# EAGLE design BATT_CPU_mod (EAGLE 9.6.2)
COMPANY: ADAFRUIT INDUSTRIES; DRAWN: KTOWN; REV: B
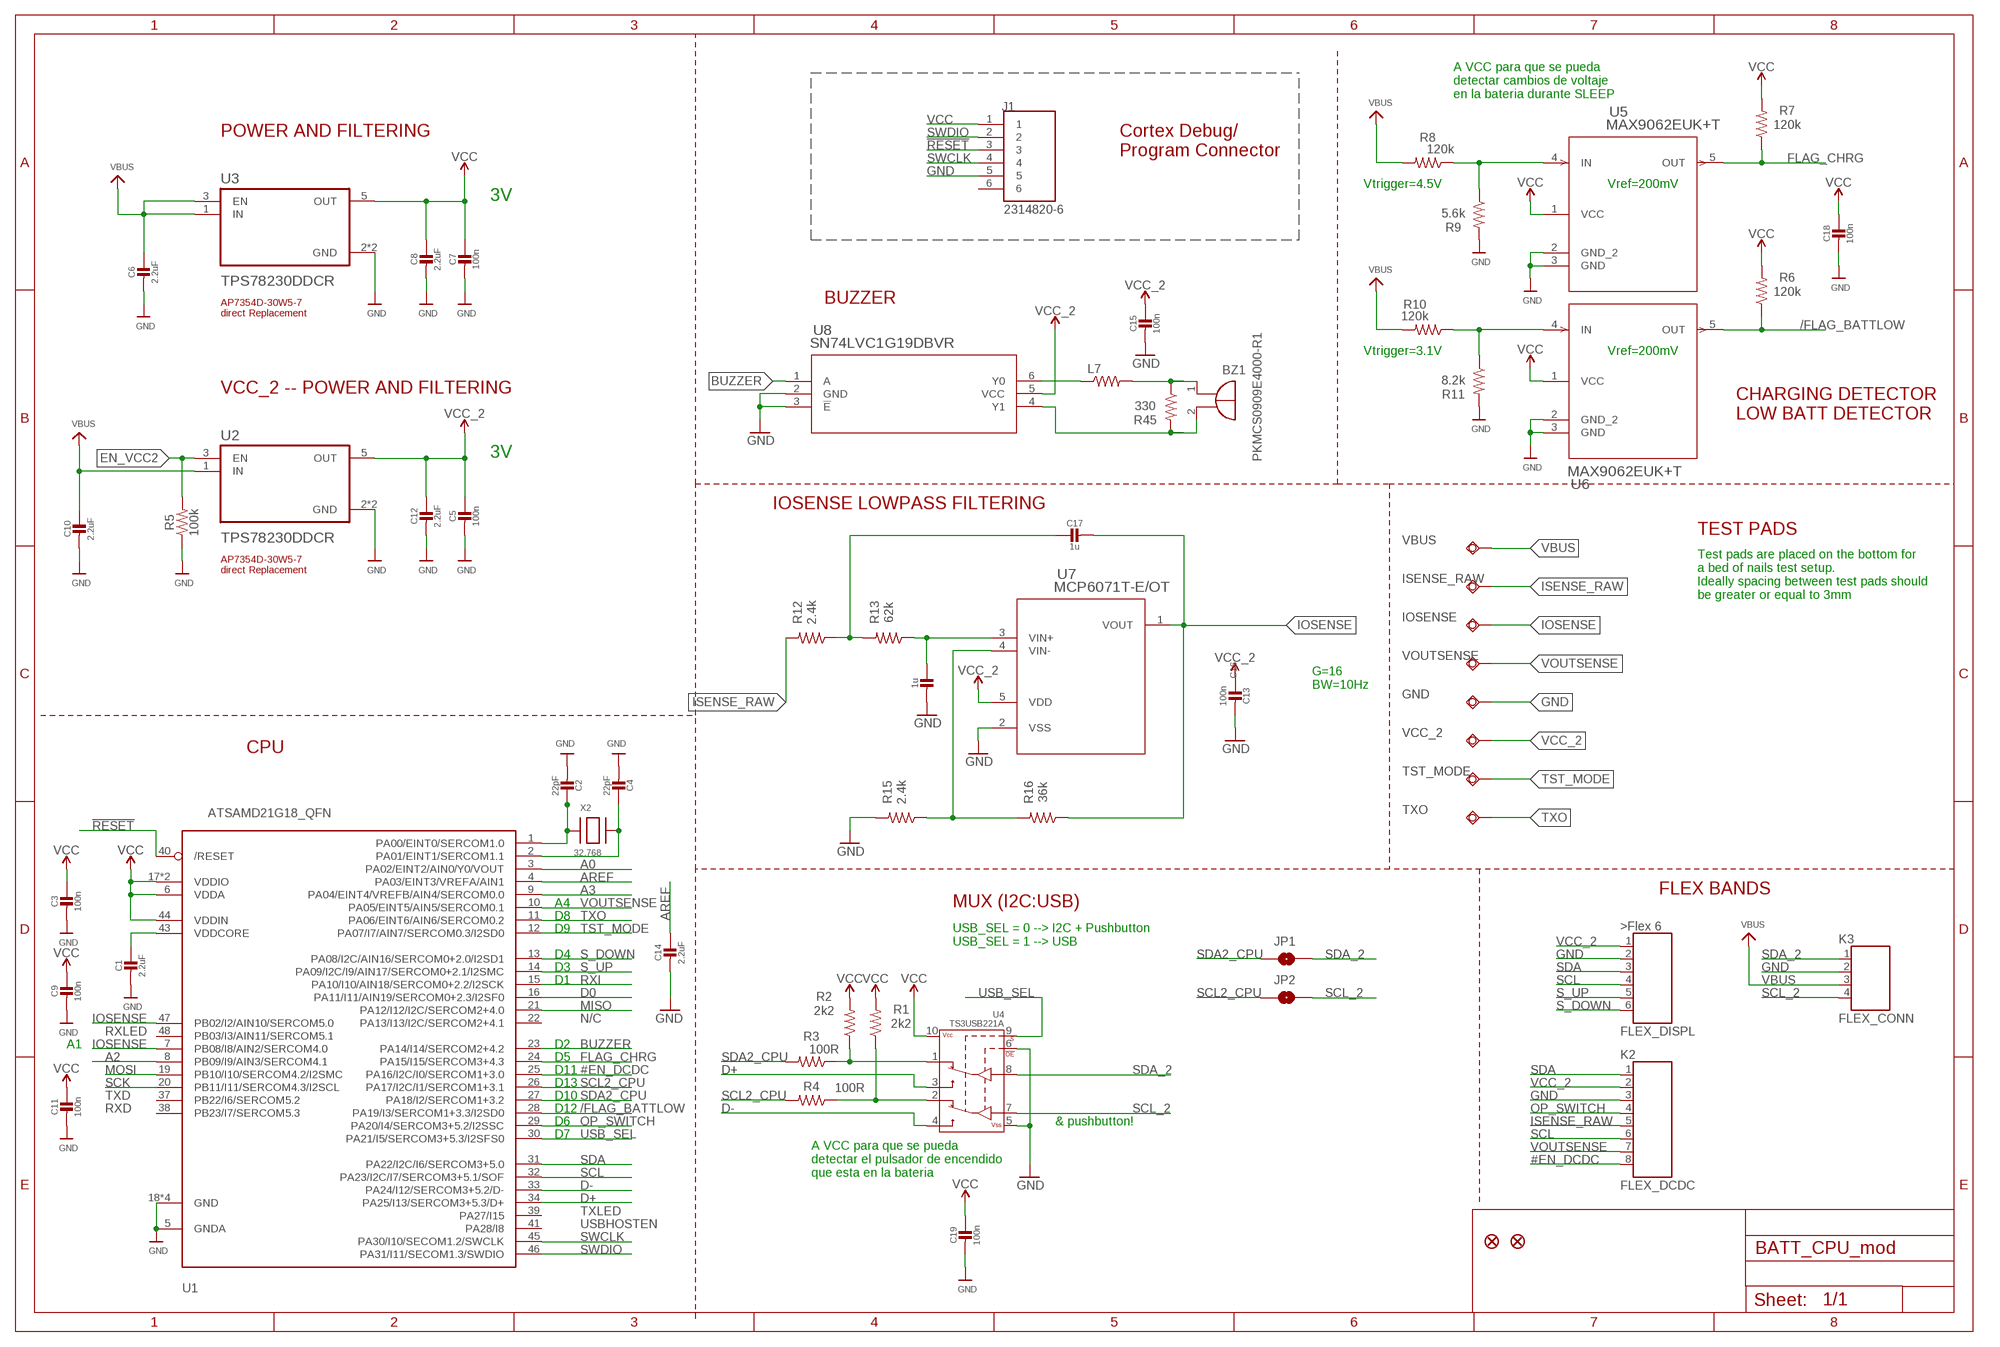
[diagram p0: schematic, sheet 1]

## Parts
BZ1  PKMCS0909E4000-R1  [PKMCS0909]
C1  2.2uF  CAP_CERAMIC0603_NO  [0603-NO]
C2  22pF  CAP_CERAMIC0603_NO  [0603-NO]
C3  100n  CAP_CERAMIC0603_NO  [0603-NO]
C4  22pF  CAP_CERAMIC0603_NO  [0603-NO]
C5  100n  CAP_CERAMIC0603_NO  [0603-NO]
C6  2.2uF  CAP_CERAMIC0805-NOOUTLINE  [0805-NO]
C7  100n  CAP_CERAMIC0603_NO  [0603-NO]
C8  2.2uF  CAP_CERAMIC0805-NOOUTLINE  [0805-NO]
C9  100n  CAP_CERAMIC0603_NO  [0603-NO]
C10  2.2uF  CAP_CERAMIC0805-NOOUTLINE  [0805-NO]
C11  100n  CAP_CERAMIC0603_NO  [0603-NO]
C12  2.2uF  CAP_CERAMIC0805-NOOUTLINE  [0805-NO]
C13  100n  CAP_CERAMIC0603_NO  [0603-NO]
C14  2.2uF  CAP_CERAMIC0603_NO  [0603-NO]
C15  100n  CAP_CERAMIC0603_NO  [0603-NO]
C16  1u  CAP_CERAMIC0603_NO  [0603-NO]
C17  1u  CAP_CERAMIC0603_NO  [0603-NO]
C18  100n  CAP_CERAMIC0603_NO  [0603-NO]
C19  100n  CAP_CERAMIC0603_NO  [0603-NO]
GND  TESTPAD_TPSQB1,27  [TESTPAD_B1,27]
IOSENSE  TESTPAD_TPSQB1,27  [TESTPAD_B1,27]
ISENSE_RAW  TESTPAD_TPSQB1,27  [TESTPAD_B1,27]
J1  2314820-6  [TE_2314820-6]
JP1  JUMPER-SMT_2_NO_SILK  [SMT-JUMPER_2_NO_SILK]
JP2  JUMPER-SMT_2_NO_SILK  [SMT-JUMPER_2_NO_SILK]
K1  FLEX_DISPL  FLEX6  [FLEX6]
K2  FLEX_DCDC  FLEX8  [FLEX8]
K3  FLEX_CONN  FLEX4  [FLEX4]
L7  MMZ2012Y202BT000  RESISTOR0805-RES  [0805]
R1  2k2  RESISTOR0603  [0603]
R2  2k2  RESISTOR0603  [0603]
R3  100R  RESISTOR0603  [0603]
R4  100R  RESISTOR0603  [0603]
R5  100k  RESISTOR0603  [0603]
R6  120k  RESISTOR0603  [0603]
R7  120k  RESISTOR0603  [0603]
R8  120k  RESISTOR0603  [0603]
R9  5.6k  RESISTOR0603  [0603]
R10  120k  RESISTOR0603  [0603]
R11  8.2k  RESISTOR0603  [0603]
R12  2.4k  RESISTOR0603  [0603]
R13  62k  RESISTOR0603  [0603]
R15  2.4k  RESISTOR0603  [0603]
R16  36k  RESISTOR0603  [0603]
R45  330  RESISTOR0603  [0603]
TST_MODE  TESTPAD_TPSQB1,27  [TESTPAD_B1,27]
TXO  TESTPAD_TPSQB1,27  [TESTPAD_B1,27]
U1  ATSAMD21G18_QFN  ATSAMD21J_QFN  [TQFN48_7MM]
U2  TPS78230DDCR  [SOT95P280X110-5N]
U3  TPS78230DDCR  [SOT95P280X110-5N]
U4  TS3USB221A  [QFN-10-RSE]
U5  MAX9062EUK+T  [21-0057F_MXM]
U6  MAX9062EUK+T  [21-0057F_MXM]
U7  MCP6071T-E/OT  [SOT-23-5_MC_MCH]
U8  SN74LVC1G19DBVR  [DBV6]
U$34  FIDUCIAL""  [FIDUCIAL_1MM]
U$35  FIDUCIAL""  [FIDUCIAL_1MM]
VBUS  TESTPAD_TPSQB1,27  [TESTPAD_B1,27]
VCC_2  TESTPAD_TPSQB1,27  [TESTPAD_B1,27]
VOUTSENSE  TESTPAD_TPSQB1,27  [TESTPAD_B1,27]
X2  32.768  XTAL-3.2X1.5  [XTAL3215]

## Nets
!RESET: J1.3 U1.40(/RESET)
#EN_DCDC: K2.8 U1.25(PA16/I2C/I0/SERCOM1+3.0)
/FLAG_BATTLOW: R6.1 U1.28(PA19/I3/SERCOM1+3.3/I2SD0) U6.5(OUT)
A0: U1.3(PA02/EINT2/AIN0/Y0/VOUT)
A2: U1.8(PB09/I9/AIN3/SERCOM4.1)
A3: U1.9(PA04/EINT4/VREFB/AIN4/SERCOM0.0)
AREF: C14.1 U1.4(PA03/EINT3/VREFA/AIN1)
BUZZER: U1.23(PA14/I14/SERCOM2+4.2) U8.1(A)
D0: U1.16(PA11/I11/AIN19/SERCOM0+2.3/I2SF0)
D+: U1.34(PA25/I13/SERCOM3+5.3/D+) U4.3(2D+)
D-: U1.33(PA24/I12/SERCOM3+5.2/D-) U4.4(2D-)
EN_VCC2: R5.2 U2.3(EN)
FLAG_CHRG: R7.1 U1.24(PA15/I15/SERCOM3+4.3) U5.5(OUT)
GND: C1.2 C2.2 C3.2 C4.2 C5.2 C6.2 C7.2 C8.2 C9.2 C10.2 C11.2 C12.2 C13.2 C14.2 C15.2 C16.2 C18.2 C19.2 GND.TP J1.5 K1.2 K2.3 K3.2 R5.1 R9.2 R11.2 R15.2 U1.5(GNDA) U1.18(GND) U1.35(GND) U1.42(GND) U1.THERMAL(GND) U2.2(GND) U2.4(GND) U3.2(GND) U3.4(GND) U4.5(VSS) U4.6(!OE) U5.2(GND_2) U5.3(GND) U6.2(GND_2) U6.3(GND) U7.2(VSS) U8.2(GND) U8.3(!E)
IOSENSE: C17.2 IOSENSE.TP R16.1 U1.7(PB08/I8/AIN2/SERCOM4.0) U1.47(PB02/I2/AIN10/SERCOM5.0) U7.1(VOUT)
ISENSE_RAW: ISENSE_RAW.TP K2.5 R12.2
MISO: U1.21(PA12/I12/I2C/SERCOM2+4.0)
MOSI: U1.19(PB10/I10/SERCOM4.2/I2SMC)
N$1: R15.1 R16.2 U7.4(VIN-)
N$2: R2.1 R3.1 U4.1(1D+)
N$3: R1.1 R4.1 U4.2(1D-)
N$5: C2.1 U1.1(PA00/EINT0/SERCOM1.0) X2.P$1
N$7: C4.1 U1.2(PA01/EINT1/SERCOM1.1) X2.P$2
N$8: C17.1 R12.1 R13.2
N$10: R10.1 R11.1 U6.4(IN)
N$11: R8.1 R9.1 U5.4(IN)
N$13: C16.1 R13.1 U7.3(VIN+)
N$17: L7.1 U8.6(Y0)
N$19: BZ1.1(+) L7.2 R45.1
N$22: BZ1.2(-) R45.2 U8.4(Y1)
OP_SWITCH: K2.4 U1.29(PA20/I4/SERCOM3+5.2/I2SSC)
RXI: U1.15(PA10/I10/AIN18/SERCOM0+2.2/I2SCK)
S_DOWN: K1.6 U1.13(PA08/I2C/AIN16/SERCOM0+2.0/I2SD1)
S_UP: K1.5 U1.14(PA09/I2C/I9/AIN17/SERCOM0+2.1/I2SMC)
SCK: U1.20(PB11/I11/SERCOM4.3/I2SCL)
SCL: K1.4 K2.6 U1.32(PA23/I2C/I7/SERCOM3+5.1/SOF)
SCL2_CPU: JP2.1 R4.2 U1.26(PA17/I2C/I1/SERCOM1+3.1)
SCL_2: JP2.2 K3.4 U4.7(D-)
SDA: K1.3 K2.1 U1.31(PA22/I2C/I6/SERCOM3+5.0)
SDA2_CPU: JP1.1 R3.2 U1.27(PA18/I2/SERCOM1+3.2)
SDA_2: JP1.2 K3.1 U4.8(D+)
SWCLK: J1.4 U1.45(PA30/I10/SECOM1.2/SWCLK)
SWDIO: J1.2 U1.46(PA31/I11/SECOM1.3/SWDIO)
TST_MODE: TST_MODE.TP U1.12(PA07/I7/AIN7/SERCOM0.3/I2SD0)
TXO: TXO.TP U1.11(PA06/EINT6/AIN6/SERCOM0.2)
USB_SEL: U1.30(PA21/I5/SERCOM3+5.3/I2SFS0) U4.9(S)
VBUS: C6.1 C10.1 K3.3 R8.2 R10.2 U2.1(IN) U3.1(IN) U3.3(EN) VBUS.TP
VCC: C3.1 C7.1 C8.1 C9.1 C11.1 C18.1 C19.1 J1.1 R1.2 R2.2 R6.2 R7.2 U1.6(VDDA) U1.17(VDDIO) U1.36(VDDIO) U1.44(VDDIN) U3.5(OUT) U4.10(VCC) U5.1(VCC) U6.1(VCC)
VCC_2: C5.1 C12.1 C13.1 C15.1 K1.1 K2.2 U2.5(OUT) U7.5(VDD) U8.5(VCC) VCC_2.TP
VDDCORE: C1.1 U1.43(VDDCORE)
VOUTSENSE: K2.7 U1.10(PA05/EINT5/AIN5/SERCOM0.1) VOUTSENSE.TP
Unconnected: J1.6 U1.22(PA13/I13/I2C/SERCOM2+4.1) U1.37(PB22/I6/SERCOM5.2) U1.38(PB23/I7/SERCOM5.3) U1.39(PA27/I15) U1.41(PA28/I8) U1.48(PB03/I3/AIN11/SERCOM5.1)

## Notes on the sheet
- A VCC para que se pueda
  detectar cambios de voltaje
  en la bateria durante SLEEP
- Cortex Debug/
  Program Connector
- POWER AND FILTERING
- Vtrigger=4.5V | Vref=200mV
- 3V
- BUZZER
- AP7354D-30W5-7 
  direct Replacement
- Vtrigger=3.1V | Vref=200mV
- VCC_2 -- POWER AND FILTERING
- CHARGING DETECTOR
  LOW BATT DETECTOR
- 3V
- IOSENSE LOWPASS FILTERING
- TEST PADS
- AP7354D-30W5-7 
  direct Replacement
- Test pads are placed on the bottom for
  a bed of nails test setup.
  Ideally spacing between test pads should 
  be greater or equal to 3mm
- G=16
  BW=10Hz
- CPU
- FLEX BANDS
- A4 | MUX (I2C:USB)
- D8
- D9
- USB_SEL = 0 --> I2C + Pushbutton
  USB_SEL = 1 --> USB
- D4
- D3
- D1
- N/C
- RXLED
- A1 | D2
- D5
- D11
- D13
- TXD | D10
- RXD | D12
- D6 | & pushbutton!
- D7
- A VCC para que se pueda
  detectar el pulsador de encendido
  que esta en la bateria
- TXLED
- USBHOSTEN

## Library data of the parts
BZ1 = buzzer:PKMCS0909E4000-R1: PKMCS0909E4000-R1 Source : http://www.murata.com/~/media/webrenewal/products/sound/sounder/vppt-buzj083-d.ashx
C1-C19 = microbuilder:CAP_CERAMIC: Ceramic Capacitors For new designs, use the packages preceded by an '_' character since they are more reliable: The following footprints should be used on most boards: _0402 - Standard footprint for regular board layouts _0603 - Standard footprint for regular board layouts _0805 - Standard footprint for regular board layouts _1206 - Standard footprint for regular board layouts For extremely tight-pitch boards where space is at a premium, the following 'micro-pitch' footprints can be used (smaller pads, no silkscreen outline, etc.): _0402MP - Micro-pitch footprint for very dense/compact boards _0603MP - Micro-pitch footprint for very dense/compact boards _0805MP - Micro-pitch footprint for very dense/compact boards _1206MP - Micro-pitch footprint for very dense/compact boards
GND IOSENSE ISENSE_RAW TST_MODE TXO VBUS VCC_2 VOUTSENSE = BeagleBone_Blue_R3:TESTPAD_TPSQ: Test pad
J1 = connector 2x3-2mm:2314820-6; COMMENT: 2314820-6; DESCRIPTION: Socket Receptacle 6P,2MM,B-B,REC,DRVT,2.7,0.1AU,TB 6 POS; DIGI-KEY_PART_NUMBER: 17-2314820-6-ND; MF: TE Connectivity; MP: 2314820-6; PACKAGE: None; PURCHASE-URL: https://pricing.snapeda.com/search/part/2314820-6/?ref=eda
JP1 JP2 = SparkFun-Jumpers:JUMPER-SMT_2_NO: Normally open jumper This jumper has two pads in close proximity to each other. Apply solder to close the connection. Round pads are easier to solder for beginners, but are a lot larger. SparkFun Product that uses the round pads: SparkFun EL Sequencer <https://www.sparkfun.com/products/12781>
K1 = Flex_Faja_connector:FLEX6: WR-FPC 1mm SMT Horiz. Bot. Contact Hinge type WR-FPC 1mm 06 pins Hinge type SMT Horizontal Bottom Contact ;=>Code : Con_FPC_ZIF_1.00_6861xx148922_686106148922 <http://katalog.we-online.de/media/images/eican/Con_FPC_ZIF_1.00_686110148922_pf2.jpg> Details see: http://katalog.we-online.de/em/datasheet/6861xx148922.pdf Created 2014-10-08, Karrer Zheng 2014 (C) Wurth Elektronik
K2 = Flex_Faja_connector:FLEX8: WR-FPC 1mm SMT Horiz. Bot. Contact Hinge type WR-FPC 1mm 08 pins Hinge type SMT Horizontal Bottom Contact ;=>Code : Con_FPC_ZIF_1.00_6861xx148922_686108148922 <http://katalog.we-online.de/media/images/eican/Con_FPC_ZIF_1.00_686110148922_pf2.jpg> Details see: http://katalog.we-online.de/em/datasheet/6861xx148922.pdf Created 2014-10-08, Karrer Zheng 2014 (C) Wurth Elektronik
K3 = Flex4:FLEX4
L7 = SparkFun:RESISTOR: Resistor Basic schematic elements and footprints for 0603, 1206, and PTH resistors.
R1-R13 R15 R16 R45 = SparkFun-Resistors:RESISTOR: Generic Resistor Package
U1 = microbuilder:ATSAMD21J
U2 U3 = TPS78230DDCR:TPS78230DDCR: Check prices <https://pricing.snapeda.com/parts/TPS78230DDCR/Texas%20Instruments/view-part?ref=eda>; AVAILABILITY: Good; DESCRIPTION: 150-mA, nano-IQ, low-dropout voltage regulator with enable from -40C to +125C 5-SOT-23-THIN -40 to 125; MF: Texas Instruments; MP: TPS78230DDCR; PACKAGE: SOT-23-THN-5 Texas Instruments; PRICE: None; PURCHASE-URL: https://pricing.snapeda.com/search/part/TPS78230DDCR/?ref=eda
U4 = SparkFun-IC-Special-Function:TS3USB221A: DPDT Analog Mux DPDT Analog Mux Vcc 2.5 to 3.3V Passes up to 5.5V at 3.3V supply 900MHz BW, 6Ω switch resistance SparkFun Products SparkFun FTDI SmartBasic <https://www.sparkfun.com/products/12935> (DEV-12935); PROD_ID: IC-12115
U5 U6 = MAX9062:MAX9062EUK+T; BUILT_BY: EMA_UL_Team; MANUFACTURER_PART_NUMBER: MAX9062EUK+T; SOURCELIBRARY: Maxim_2014-06-20; VENDOR: Maxim Integrated Products
U7 = MCP6071:MCP6071T-E/OT; BUILT_BY: EMA_Jessica; COPYRIGHT: Copyright (C) 2018 Accelerated Designs. All rights reserved; MANUFACTURER_PART_NUMBER: MCP6071T-E/OT; SOURCELIBRARY: Microchip_2019-08-23_21; VENDOR: Microchip
U8 = SN74LVC1G19DBVR:SN74LVC1G19DBVR; DATASHEET_URL: http://www.ti.com/lit/gpn/SN74LVC1G19; DESCRIPTION: 1-of-2 Decoder/Demultiplexer; FAMILY_NAME: LL Decoder, Mux/Demux; GENERIC_PART_NUMBER: SN74LVC1G19; INDUSTRY_STD_PKG_TYPE: SOT-23; MANUFACTURER: Texas Instruments; MANUFACTURER_PART_NUMBER: SN74LVC1G19DBVR; PACKAGE_DESIGNATOR: DBV; PIN_COUNT: 6; VENDOR: Texas Instruments
U$34 U$35 = microbuilder:FIDUCIAL: Fiducial Alignment Points Various fiducial points for machine vision alignment.; BOM: EXCLUDE
X2 = adafruit2:XTAL: Low cost SMT crystals, no capacitors included http://www.ladyada.net/library/eagle

## Net classes
2 gnd: width 0.305 mm, drill 0.483 mm, clearance 0.203 mm

## Board
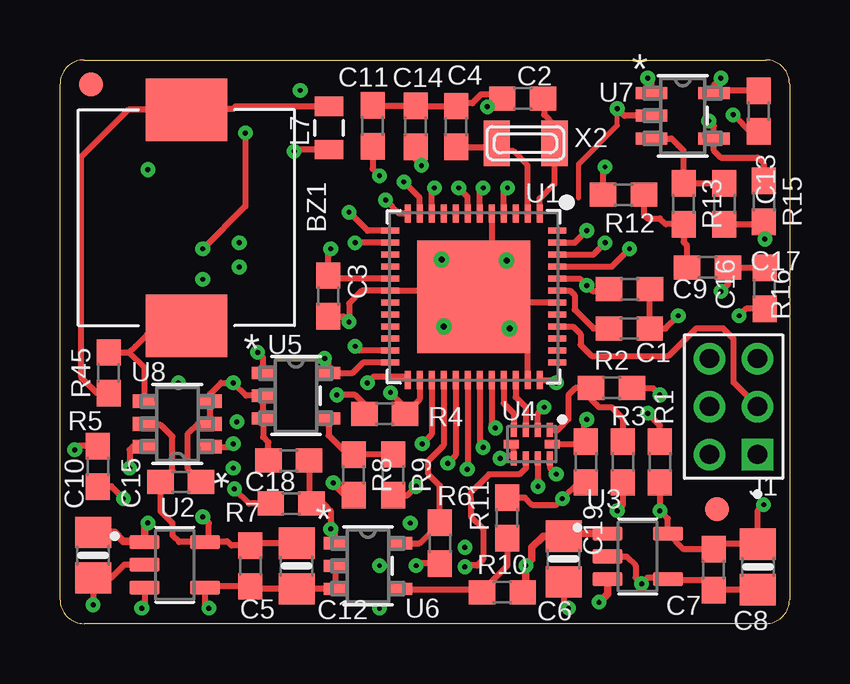
[diagram p1: board, top side]
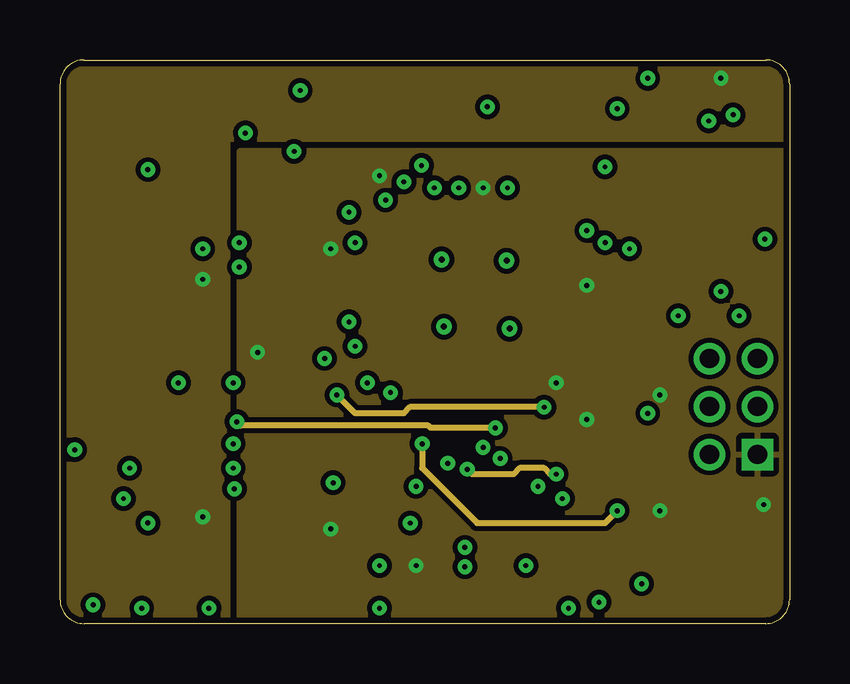
[diagram p2: board, inner layer Route2]
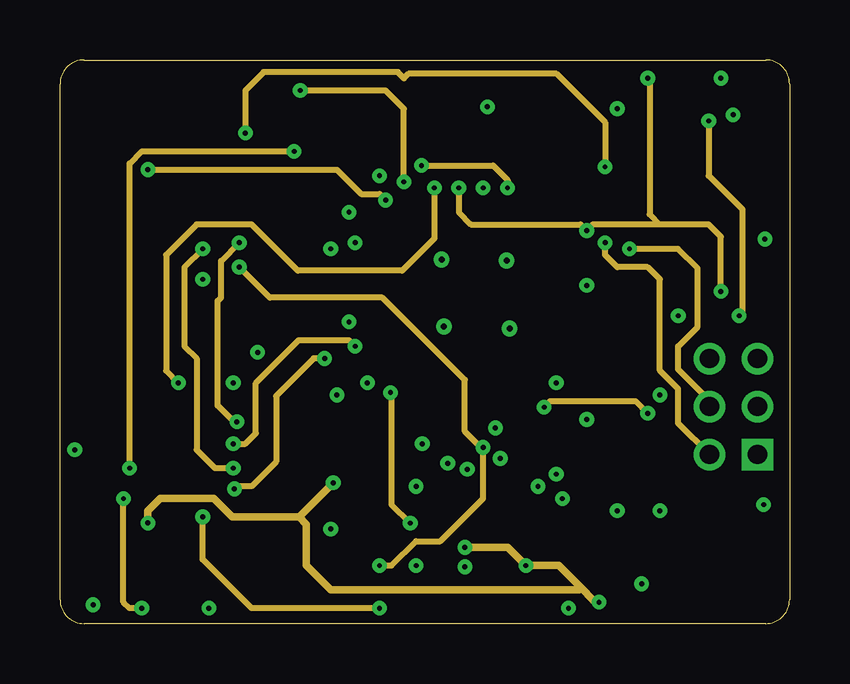
[diagram p3: board, inner layer Route15]
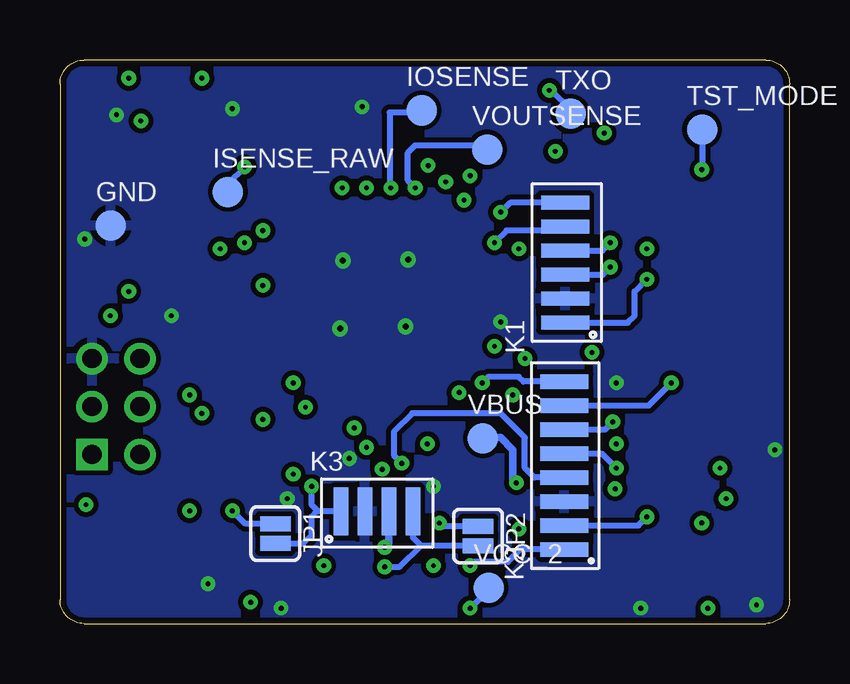
[diagram p4: board, bottom side, seen from below]

Size 30.4 x 23.5 mm. Coordinates in mm from the lower left corner, seen from the top.
Outline: 1,23.5 29.4,23.5 arc-90 30.4,22.5 30.4,1 arc-90 29.4,0 1,0 arc-90 0,1 0,22.5 arc-90 1,23.5
Copper layers (1+2*15+16): Top 0.035mm / dielectric 1.5mm / Route2 0.035mm / dielectric 0.15mm / Route15 0.035mm / dielectric 0.2mm / Bottom 0.035mm
Design rules "adafruit *": minimum track width 8mil, minimum drill 0.2mm, track to track 8mil, track to pad 8mil, pad to pad 8mil, via to via 8mil, smd to smd 8mil, copper to edge 10mil, drill to drill 8mil, minimum pad ring 10mil, minimum via ring 8mil, stop-mask expansion 2mil, vias tented up to drill 20mil, thermal gap 10mil
tRestrict: area -2.4,8.3 to -2.1,11.1; area -1.7,13.5 to 3.3,13.8; area 2.8,11.1 to 3.3,13.6

### Footprints (pad centres in the part's own frame; a part is rotated, then mirrored left to right if it is on the bottom)
PKMCS0909 = smd 2.6 x 3.4: 1 -4.5,0; 2 4.5,0
0603-NO = smd 1.1 x 1: 1 -0.85,0; 2 0.85,0
0805-NO = smd 1.3 x 1.5: 1 -0.95,0; 2 0.95,0
TESTPAD_B1,27 = smd 1.27 x 1.27: TP 0,0
TE_2314820-6 = drill 0.8 pad 1.15 square: 1 0,0 | drill 0.8 pad 1.15: 2 0,2; 3 2,0; 4 2,2; 5 4,0; 6 4,2
SMT-JUMPER_2_NO_SILK = smd 0.635 x 1.27: 1 -0.406,0; 2 0.406,0
FLEX6 = smd 0.6 x 2: 1 -2.5,0.25; 2 -1.5,0.25; 3 -0.5,0.25; 4 0.5,0.25; 5 1.5,0.25; 6 2.5,0.25
FLEX8 = smd 0.6 x 2: 1 -3.5,0.25; 2 -2.5,0.25; 3 -1.5,0.25; 4 -0.5,0.25; 5 0.5,0.25; 6 1.5,0.25; 7 2.5,0.25; 8 3.5,0.25
FLEX4 = smd 0.6 x 2: 1 -3.77,1.52; 2 -2.77,1.52; 3 -1.77,1.52; 4 -0.77,1.52
0805 = smd 0.8 x 1.2: 1 -0.9,0; 2 0.9,0
0603 = smd 1.1 x 1: 1 -0.85,0; 2 0.85,0
TQFN48_7MM = smd 0.25 x 0.75: 1 -2.75,-3.475; 2 -2.25,-3.475; 3 -1.75,-3.475; 4 -1.25,-3.475; 5 -0.75,-3.475; 6 -0.25,-3.475; 7 0.25,-3.475; 8 0.75,-3.475; 9 1.25,-3.475; 10 1.75,-3.475; 11 2.25,-3.475; 12 2.75,-3.475; 25 2.75,3.475; 26 2.25,3.475; 27 1.75,3.475; 28 1.25,3.475; 29 0.75,3.475; 30 0.25,3.475; 31 -0.25,3.475; 32 -0.75,3.475; 33 -1.25,3.475; 34 -1.75,3.475; 35 -2.25,3.475; 36 -2.75,3.475 | smd 0.75 x 0.25: 13 3.475,-2.75; 14 3.475,-2.25; 15 3.475,-1.75; 16 3.475,-1.25; 17 3.475,-0.75; 18 3.475,-0.25; 19 3.475,0.25; 20 3.475,0.75; 21 3.475,1.25; 22 3.475,1.75; 23 3.475,2.25; 24 3.475,2.75; 37 -3.475,2.75; 38 -3.475,2.25; 39 -3.475,1.75; 40 -3.475,1.25; 41 -3.475,0.75; 42 -3.475,0.25; 43 -3.475,-0.25; 44 -3.475,-0.75; 45 -3.475,-1.25; 46 -3.475,-1.75; 47 -3.475,-2.25; 48 -3.475,-2.75 | smd 4.7 x 4.7: THERMAL 0,0
SOT95P280X110-5N = smd 1.25 x 0.59: 1 -1.255,0.95; 2 -1.255,0; 3 -1.255,-0.95; 4 1.255,-0.95; 5 1.255,0.95
QFN-10-RSE = smd 0.58 x 0.25: 1 -0.6,0.75; 2 -0.6,0.25; 3 -0.6,-0.25; 4 -0.6,-0.75; 6 0.6,-0.75; 7 0.6,-0.25; 8 0.6,0.25; 9 0.6,0.75 | smd 0.35 x 0.63: 5 0,-0.85; 10 0,0.85
21-0057F_MXM = smd 0.972 x 0.508: 1 -1.362,0.95; 2 -1.362,0; 3 -1.362,-0.95; 4 1.362,-0.95; 5 1.362,0.95
SOT-23-5_MC_MCH = smd 1.31 x 0.508: 1 -1.295,0.95; 2 -1.295,0; 3 -1.295,-0.95; 4 1.295,-0.95; 5 1.295,0.95
DBV6 = smd 0.972 x 0.568: 1 -1.362,0.95; 2 -1.362,0; 3 -1.362,-0.95; 4 1.362,-0.95; 5 1.362,0; 6 1.362,0.95
FIDUCIAL_1MM = smd 1 x 1: 1 0,0
XTAL3215 = smd 1.1 x 1.9: P$1 1.2,0; P$2 -1.2,0

### Placement (x,y rotation side)
BZ1  5.27,16.92 270 top
C1  23.72,12.29 0 top
C2  19.28,21.89 180 top
C3  11.17,13.66 270 top
C4  16.5,20.72 90 top
C5  7.93,2.4 270 top
C6  20.98,2.69 270 top
C7  27.23,2.25 270 top
C8  29.08,2.36 270 top
C9  23.73,13.94 0 top
C10  1.38,2.85 270 top
C11  13.03,20.75 90 top
C12  9.86,2.4 270 top
C13  29.11,21.37 270 top
C14  14.82,20.73 90 top
C15  5.03,5.9 0 top
C16  27.68,17.5 270 top
C17  26.98,14.85 0 top
C18  9.53,6.8 180 top
C19  21.91,6.73 270 top
GND  28.28,16.59 0 bottom
IOSENSE  15.33,21.4 0 bottom
ISENSE_RAW  23.4,17.99 0 bottom
J1  29.06,7.05 90 top
JP1  21.43,3.75 270 bottom
JP2  12.98,3.65 270 bottom
K1  9.1,15.05 90 bottom
K2  9.13,6.59 90 bottom
K3  14.93,3.15 0 bottom
L7  11.21,20.66 90 top
R1  25,6.73 270 top
R2  22.98,9.82 0 top
R3  23.44,6.73 270 top
R4  13.53,8.73 0 top
R5  1.58,6.55 270 top
R6  15.83,3.35 270 top
R7  9.63,5 0 top
R8  12.23,6.2 270 top
R9  13.88,6.2 270 top
R10  18.43,1.3 0 top
R11  18.63,4.4 90 top
R12  23.48,17.88 180 top
R13  25.98,17.5 270 top
R15  29.33,17.6 270 top
R16  29.35,13.98 270 top
R45  2.03,10.45 90 top
TST_MODE  3.65,20.6 0 bottom
TXO  9.12,21.25 0 bottom
U1  17.24,13.63 180 top
U2  4.78,2.45 0 top
U3  24.07,2.8 0 top
U4  19.66,7.48 270 top
U5  9.83,9.5 0 top
U6  12.83,2.4 0 top
U7  25.95,21.17 0 top
U8  4.89,8.32 180 top
U$34  27.37,4.76 90 top
U$35  1.3,22.47 0 top
VBUS  12.78,7.73 0 bottom
VCC_2  12.54,1.5 0 bottom
VOUTSENSE  12.6,19.77 0 bottom
X2  19.4,20.03 0 top

### Tracks (layer width: path | path; a pad name or v marks a point on that pad's centre or on a via)
!RESET
  Top 0.254: J1.3 28.06,10.05 28.06,11.87 27.62,12.32 26.52,12.32 25.36,11.16 22.16,11.16 21.7,11.62 21.7,12.07 21.39,12.38 U1.40
#EN_DCDC  (via drill 0.2)
  Top 0.254: U1.25 14.47,10.15 14.33,10.29 13.06,10.29 v12.81,10.04
  Bottom 0.254: K2.8 11.08,10.09 11.28,10.29 12.55,10.29 v12.81,10.04
/FLAG_BATTLOW
  Top 0.254: U6.5 14.98,3.35 R6.1 15.83,5.74 15.35,6.23 15.35,6.79 15.9,7.34 15.99,7.43 U1.28
AREF  (via drill 0.2)
  Top 0.254: U1.4 18.49,18.01 v18.65,18.16 | C14.1 14.82,19.33 v15.06,19.1
  Route15 0.254: v15.06,19.1 18.05,19.1 18.65,18.49 v18.65,18.16
BUZZER  (via drill 0.2)
  Top 0.254: U1.23 12.48,11.38 v12.3,11.56 | U8.1 7.09,7.37 v7.22,7.5
  Route15 0.254: v7.22,7.5 7.73,7.5 8.16,7.93 8.16,10.03 9.95,11.81 12.04,11.81 v12.3,11.56
D+
  Top 0.254: U1.34 18.99,9.44 19.41,9.02 U4.3
D-
  Top 0.254: U1.33 18.49,9.18 18.9,8.77 U4.4
EN_VCC2  (via drill 0.2)
  Top 0.254: U2.3 3.52,0.76 v3.41,0.64 | R5.2 1.6,5.72 2.14,5.72 v2.65,5.21
  Route15 0.254: v3.41,0.64 2.9,0.64 2.65,0.89 v2.65,5.21
FLAG_CHRG  (via drill 0.2)
  Top 0.254: U1.24 12.63,10.88 12.2,10.45 U5.5 11.19,10.89 v11.03,11.05 | R7.1 7.88,5 v7.27,5.62
  Route15 0.254: v11.03,11.05 10.57,11.05 9,9.49 9,6.74 7.98,5.72 7.37,5.72 v7.27,5.62
GND  (via drill 0.2, 0.25)
  Top 0.203: v23.22,21.47 23.22,20.77 21.61,19.16 21.61,17.75
  Top 0.254: C15.2 5.33,6.45 5.33,7.92 5.73,8.32 U8.2 U8.3 6.25,9.58 6.71,10.04 v7.22,10.04 7.75,9.5 U5.2 U5.3 8.47,7.77 8.68,7.56 C18.2 | C8.2 27.24,1.41 C7.2 27.23,1.8 25.37,1.8 U3.4 25.31,1.85 25.25,1.91 24.49,1.91 v24.24,1.65 23.98,1.91 23.98,2.42 23.6,2.8 U3.2 | C6.2 20.98,0.84 v21.19,0.64 | U6.2 U6.3 C12.2 8.03,1.45 C5.2 6.08,1.55 U2.4 6.03,0.81 v6.2,0.64 | v1.38,0.78 C10.2 2.14,1.91 2.68,2.45 U2.2 | R5.1 0.77,7.4 v0.61,7.24 | U1.THERMAL 16.99,13.88 U1.18 12.58,13.88 12.04,13.34 v12.04,12.58 11.81,12.81 C3.2 | U1.35 19.49,11.38 U1.THERMAL | U1.42 17.49,13.38 U1.THERMAL | U1.5 17.99,14.38 U1.THERMAL | U7.2 23.52,21.17 v23.22,21.47 | C11.2 14.8,21.6 C14.2 C4.2 16.62,21.69 17.18,21.69 17.54,22.05 18.27,22.05 C2.2 18.16,21.89 v17.81,21.55 | v29.37,16.03 29.33,16.07 R15.2 29.23,16.65 C16.2 | C13.2 28.87,20.52 28.81,20.45 v28.05,21.21 | U4.5 18.91,7.38 U4.6 18.91,6.98 18.9,6.99 18.44,6.99 v18.34,6.89 | C19.2 21.61,5.88 v20.93,5.21 20.68,4.96 19.66,4.96 19.37,5.25 R11.2 | v25.76,12.83 25.22,12.29 C1.2 24.57,13.93 C9.2 | R9.2 14.47,5.35 v14.84,5.72
  other vias: 18.73,12.3 18.61,15.13 15.9,15.18 16,12.38
  pour Bottom: -0.15,23.75 30.33,23.75 30.33,0.13 -0.15,0.13
IOSENSE  (via drill 0.2)
  Top 0.254: U1.47 21.44,15.88 v21.95,16.39 | R16.1 27.85,14.83 C17.2 27.83,14.14 v27.54,13.85 | U7.1 24.65,22.57 v24.49,22.74 | U1.7 16.99,17.79 v16.62,18.16
  Route15 0.254: v27.54,13.85 27.54,16.13 27.03,16.64 25,16.64 | 25,16.64 22.2,16.64 v21.95,16.39 21.7,16.64 17.12,16.64 16.62,17.15 v16.62,18.16 | v24.49,22.74 24.57,22.66 24.57,17.07 25,16.64
  Bottom 0.254: IOSENSE.TP 15.41,21.32 16.67,21.32 16.67,18.22 v16.62,18.16
ISENSE_RAW  (via drill 0.2)
  Top 0.254: R12.2 22.63,18.96 v22.71,19.04 | v7.73,20.45 7.73,17.4 v5.95,15.62
  Route15 0.254: v22.71,19.04 22.71,20.9 20.69,22.92 14.52,22.92 14.33,22.74 14.08,22.99 8.49,22.99 7.73,22.23 v7.73,20.45 | v5.95,15.62 5.19,14.86 5.19,11.56 5.69,11.05 5.69,7.24 6.46,6.48 v7.22,6.48
  Bottom 0.254: v22.71,19.04 23.4,18.35 ISENSE_RAW.TP | K2.5 7.83,7.09 v7.22,6.48
N$1  (via drill 0.2)
  Top 0.254: R15.1 29.32,18.46 29.32,19.18 29.06,19.43 27.54,19.43 27.24,19.73 U7.4 27.24,20.74 v27.03,20.96 | R16.2 28.6,13.13 v28.3,12.83
  Route15 0.254: v27.03,20.96 27.03,18.67 28.43,17.27 28.43,12.96 v28.3,12.83
N$2
  Top 0.254: R3.1 23.44,8.54 22.97,9.02 22.46,9.02 22.13,9.34 R2.1 21.48,9.82 21.19,9.53 21.19,8.51 20.76,8.08 U4.1
N$3  (via drill 0.2)
  Top 0.254: R4.1 12.68,9.15 12.3,9.53 v11.54,9.53 | R1.1 25,8.26 v24.49,8.77 | U4.2 19.91,8.76 v20.17,9.02
  Route2 0.254: v20.17,9.02 14.58,9.02 14.33,8.77 12.3,8.77 v11.54,9.53
  Route15 0.254: v20.17,9.02 20.43,9.27 23.98,9.27 v24.49,8.77
N$5
  Top 0.254: U1.1 19.99,17.73 20.6,18.34 X2.P$1 20.6,20.78 20.17,21.21 20.17,21.97 20.13,21.93 C2.1
N$7
  Top 0.254: U1.2 19.49,19.1 18.9,19.69 18.54,19.69 X2.P$2 18.05,19.87 C4.1
N$8
  Top 0.254: C17.1 26.13,15.76 25.98,15.91 R13.2 25.24,16.65 25,16.89 24.49,16.89 24.33,17.05 R12.1
N$10
  Top 0.254: R11.1 18.63,2.4 18.39,2.16 17.58,1.35 R10.1 17.48,1.3 17.38,1.4 14.24,1.4 U6.4
N$11
  Top 0.254: R9.1 R8.1 11.99,7.05 11.19,7.84 U5.4
N$13
  Top 0.254: C16.1 R13.1 25.98,19.72 25.76,19.94 25.48,20.22 U7.3
N$17  (via drill 0.2)
  Top 0.254: L7.1 9.83,19.76 v9.76,19.69 | U8.6 3.03,7.37 2.9,7.24 v2.9,6.48
  Route15 0.254: v9.76,19.69 3.41,19.69 2.9,19.18 v2.9,6.48
N$19
  Top 0.254: L7.2 7.31,21.56 7.22,21.47 5.44,21.47 5.39,21.42 BZ1.1 2.85,21.42 0.87,19.44 0.87,10.29 1.56,9.6 R45.1
N$22
  Top 0.254: R45.2 2.89,11.3 | 2.89,11.3 3.15,11.56 4.01,12.42 BZ1.2 | U8.4 3.53,10.67 2.89,11.3
OP_SWITCH  (via drill 0.2)
  Top 0.254: U1.29 16.49,7.01 v16.16,6.68
  Bottom 0.254: K2.4 10.64,6.09 11.03,6.48 11.03,7.75 12.04,8.77 15.73,8.77 16.49,8 16.49,7.01 v16.16,6.68
S_DOWN  (via drill 0.2)
  Top 0.254: U1.13 12.81,16.38 v12.04,17.15
  Bottom 0.254: K1.6 11.64,17.55 v12.04,17.15
S_UP  (via drill 0.2)
  Top 0.254: U1.14 v12.3,15.88
  Bottom 0.254: K1.5 9.5,16.39 11.79,16.39 v12.3,15.88
SCL  (via drill 0.2)
  Top 0.254: U1.32 17.99,8.31 v18.14,8.16
  Route2 0.254: 7.42,8.36 v7.37,8.41 7.52,8.26 15.35,8.26 15.45,8.16 v18.14,8.16
  Route15 0.254: v7.47,15.88 6.71,15.12 6.71,13.59 6.57,13.45 6.57,9.09 7.15,8.51 7.27,8.51 v7.37,8.41
  Bottom 0.254: K1.4 7.8,15.55 v7.47,15.88 | K2.6 7.69,8.09 v7.37,8.41
SCL2_CPU  (via drill 0.2)
  Top 0.254: U1.26 14.99,9.34 R4.2 14.38,9.02 v13.77,9.63
  Route15 0.254: v14.59,4.19 13.82,4.96 13.82,9.58 v13.77,9.63
  Bottom 0.254: JP2.1 14.46,4.06 v14.59,4.19
SCL_2  (via drill 0.2)
  Top 0.254: U4.7 19.41,6.48 19.16,6.23 17.89,6.23 17.38,5.72 17.12,5.46 17.12,5.21 17.12,4.45 17.63,3.94 17.63,2.67 17.38,2.42 16.92,2.42 v16.87,2.37
  Bottom 0.254: K3.4 15.7,3.59 15.36,3.24 | JP2.2 15.36,3.24 | v16.87,2.37 16.24,2.37 15.36,3.24
SDA  (via drill 0.2)
  Top 0.254: U1.31 17.49,7.49 v17.63,7.34
  Route15 0.254: v13.31,2.42 13.82,2.42 14.84,3.43 15.85,3.43 17.63,5.21 v17.63,7.34 17.53,7.34 16.87,8 16.87,10.16 13.43,13.59 8.74,13.59 v7.47,14.86
  Bottom 0.254: K1.3 7.78,14.55 v7.47,14.86 | K2.1 11.22,3.09 11.74,2.57 13.16,2.57 v13.31,2.42
SDA2_CPU  (via drill 0.2)
  Top 0.254: U1.27 15.49,7.89 v15.09,7.5 | R3.2 23.44,4.93 v23.22,4.7
  Route2 0.254: v15.09,7.5 15.09,6.48 17.38,4.19 22.71,4.19 v23.22,4.7
  Bottom 0.254: v23.22,4.7 22.67,4.16 JP1.1
SDA_2  (via drill 0.2)
  Top 0.254: U4.8 19.91,5.73 v19.92,5.72
  Bottom 0.254: JP1.2 20.26,3.34 19.92,3.69 19.92,4.45 19.7,4.67 | K3.1 19.7,4.67 | 19.7,4.67 19.7,4.73 19.92,4.96 v19.92,5.72
SWCLK  (via drill 0.2)
  Top 0.254: U1.45 22.98,14.88 v23.73,15.62
  Route15 0.254: J1.4 27.06,9.29 25.76,10.59 25.76,11.56 26.57,12.37 26.57,14.82 25.76,15.62 v23.73,15.62
SWDIO  (via drill 0.2)
  Top 0.254: U1.46 22.21,15.38 v22.71,15.88
  Route15 0.254: J1.2 25.76,8.35 25.76,9.78 25,10.54 25,14.35 24.49,14.86 23.22,14.86 22.71,15.37 v22.71,15.88
TST_MODE  (via drill 0.2)
  Top 0.254: U1.12 14.12,17.1 v13.57,17.66
  Route15 0.254: v3.66,18.93 11.54,18.93 12.55,17.91 13.31,17.91 v13.57,17.66
  Bottom 0.254: TST_MODE.TP v3.65,18.94 v3.66,18.93
TXO  (via drill 0.2)
  Top 0.254: U1.11 14.99,17.76 v14.33,18.42
  Route15 0.254: v14.33,18.42 14.33,21.47 13.57,22.23 v10.01,22.23
  Bottom 0.254: TXO.TP 9.12,21.43 9.92,22.23 v10.01,22.23
USB_SEL  (via drill 0.2)
  Top 0.254: U1.30 16.99,6.45 v16.97,6.43 | U4.9 20.41,6.5 v20.68,6.23
  Route2 0.254: v20.68,6.23 20.43,6.23 20.17,6.48 19.16,6.48 18.9,6.23 17.17,6.23 v16.97,6.43
VBUS  (via drill 0.2)
  Top 0.254: 3.49,3.43 U2.1 | 21.09,3.75 C6.1 20.94,3.69
  Top 0.305: C10.1 2.28,3.8 2.65,3.43 3.49,3.43 | U3.1 21.09,3.75 | R10.2 19.28,1.52 19.41,1.65 v19.41,2.42 19.66,2.67 19.66,3.18 20.13,3.64 C6.1 | U2.1 3.52,4.06 v3.66,4.19 | R8.2 11.91,5.35 v11.38,5.87 | U3.3 22.81,1.25 v22.46,0.89
  Route15 0.305: v3.66,4.19 3.66,4.7 4.17,5.21 6.41,5.21 7.17,4.45 9.96,4.45 | 9.96,4.45 v11.38,5.87 | v22.46,0.89 22.31,0.89 21.64,1.56 | 9.96,4.45 10.27,4.14 10.27,2.42 11.28,1.4 21.64,1.4 21.64,1.56 | 21.64,1.56 20.79,2.42 v19.41,2.42 18.65,3.18 v16.87,3.18
  Bottom 0.254: 12.75,7.75 VBUS.TP
  Bottom 0.305: K3.3 16.7,3.35 v16.87,3.18 | 12.75,7.75 12.04,7.75 11.54,7.24 11.54,6.02 v11.38,5.87
VCC  (via drill 0.2)
  Top 0.254: v29.32,4.96 29.08,4.72 C8.1 27.44,3.31 C7.1 25.97,3.1 U3.5 25.32,4.38 v25,4.7 R1.2 | v11.28,15.62 11.17,15.51 C3.1 11.3,14.38 U1.17 | U5.1 8.47,11.07 v8.23,11.31 | C18.1 10.38,5.1 R7.2 10.98,5 11.28,4.7 v11.28,3.94 11.47,3.75 U6.1 | R6.2 14.92,2.5 v14.84,2.42 | C11.1 13.03,18.96 v13.31,18.67 | U1.44 21.67,14.38 v21.95,14.1 22.2,13.85 22.71,13.85 22.8,13.94 C9.1 | U1.6 17.49,18.02 v17.63,18.16 | v21.95,8.51 21.85,8.41 21.85,7.48 21.81,7.48 | U4.10 21.81,7.48 | 21.81,7.48 C19.1 | R2.2 24.71,9.82 v25,9.53 | U1.36 20.56,10.15 v20.68,10.04
  pour Route2: 30.33,19.69 7.47,19.69 7.47,-0.38 30.33,-0.38
VCC_2  (via drill 0.2)
  Top 0.203: U8.5 3.57,8.28
  Top 0.254: 3.57,8.28 4.2,8.28 4.68,7.8 4.68,6.4 C15.1 4.18,4.69 4.68,4.19 4.68,3.69 4.96,3.4 U2.5 6.17,3.4 6.2,3.43 | 6.2,3.43 6.96,3.43 7.15,3.25 C5.1 8.03,3.35 C12.1 | 6.2,3.43 6.2,4.19 v5.95,4.45 | C13.1 27.34,22.22 U7.5 27.24,22.44 v27.54,22.74
  Route15 0.254: v13.31,0.64 7.98,0.64 5.95,2.67 v5.95,4.45
  Bottom 0.254: K2.2 6.31,4.09 v5.95,4.45 | K1.1 6.74,12.55 6.46,12.83 6.46,13.85 v5.95,14.35 | VCC_2.TP 12.54,1.41 v13.31,0.64
  pour Route2: 6.96,-0.12 0.11,-0.12 0.11,23.5 30.33,23.5 30.33,20.2 6.96,20.2
VDDCORE
  Top 0.254: U1.43 21.26,13.88 21.44,13.69 21.44,13.08 22.23,12.29 C1.1
VOUTSENSE  (via drill 0.2)
  Top 0.254: U1.10 15.49,18.05 v15.6,18.16
  Route15 0.254: v15.6,18.16 15.6,16.06 14.25,14.71 9.91,14.71 7.98,16.64 5.69,16.64 4.42,15.37 4.42,10.54 v4.93,10.04
  Bottom 0.254: v15.6,18.16 15.91,18.47 15.91,19.63 15.6,19.94 12.78,19.94 VOUTSENSE.TP | K2.7 5.88,9.09 v4.93,10.04